# Altium schematic sheet MicroSD Card.SchDoc
size 297 x 209 mm
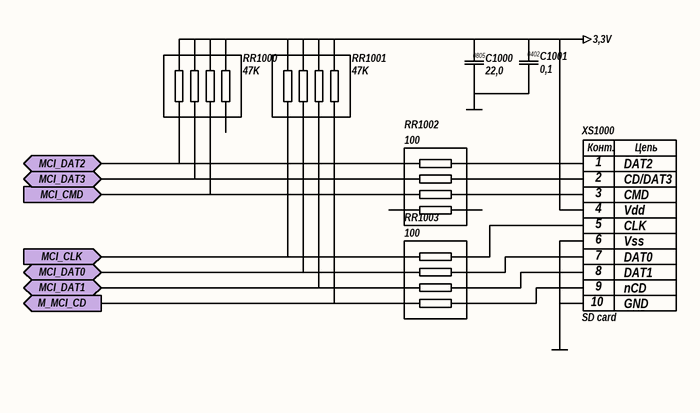
[diagram p0: MicroSD Card.SchDoc]

## Parts
C1000  22,0  [CAP0805]
C1001  0,1  [CAP0402]
RR1000  47K  [CAY16]
RR1001  47K  [CAY16]
RR1002  100  [CAY16]
RR1003  100  [CAY16]
XS1000  SD card  [112J-TDAR-R-SDCARD]

## Ports
M_MCI_CD (out), MCI_CLK (in), MCI_CMD (in), MCI_DAT0, MCI_DAT1, MCI_DAT2, MCI_DAT3

## Nets
3,3V: C1000.1 C1001.1 RR1000.5 RR1000.6 RR1000.7 RR1000.8 RR1001.5 RR1001.6 RR1001.7 RR1001.8 XS1000.4(Vdd)
GND: C1000.2 C1001.2 XS1000.6(Vss) XS1000.10(GND)
M_MCI_CD: RR1001.1 RR1003.4 ; port M_MCI_CD
MCI_CLK: RR1001.4 RR1003.1 ; port MCI_CLK
MCI_CMD: RR1000.2 RR1002.3 ; port MCI_CMD
MCI_DAT0: RR1001.3 RR1003.2 ; port MCI_DAT0
MCI_DAT1: RR1001.2 RR1003.3 ; port MCI_DAT1
MCI_DAT2: RR1000.4 RR1002.1 ; port MCI_DAT2
MCI_DAT3: RR1000.3 RR1002.2 ; port MCI_DAT3
NetRR1002_6: RR1002.6 XS1000.3(CMD)
NetRR1002_7: RR1002.7 XS1000.2(CD/DAT3)
NetRR1002_8: RR1002.8 XS1000.1(DAT2)
NetRR1003_5: RR1003.5 XS1000.9(nCD)
NetRR1003_6: RR1003.6 XS1000.8(DAT1)
NetRR1003_7: RR1003.7 XS1000.7(DAT0)
NetRR1003_8: RR1003.8 XS1000.5(CLK)

Not connected (* = marked no-connect by the designer): RR1000 1; RR1002 4 5

## Notes on the sheet
- (in symbol 112J-TDAR-R-SDCARD) Конт.; Цепь

## Library data of the parts
C1000 = CAP_0805: Конденсатор чип; Тип корпуса: 0805; Тип монтажа: Поверхностный; Номинал: 22,0; Тип компонента: Конденсатор чип
C1001 = CAP_0402: Конденсатор чип; Тип корпуса: 0402; Тип монтажа: Поверхностный; Номинал: 0,1; Тип компонента: Конденсатор чип
RR1000-RR1003 = RESASM_CAY16: Сборка резисторная; Производитель: Bourns; Тип монтажа: Поверхностный; Параметры: 0.062Вт 50В; Тип компонента: Сборка резисторная
  RR1000 RR1001: Номинал: 47K; Value: 47K
  RR1002 RR1003: Номинал: 100; Value: 100
XS1000 = 112J-TDAR-R-SDCARD: Слот MMC; Тип монтажа: Поверхностный; Наименование: 112J-TDAR-R-SDCARD; Тип компонента: Слот MMC